# EAGLE schematic DumbCar (EAGLE 7.7.0)

## Sheet 1 of 2
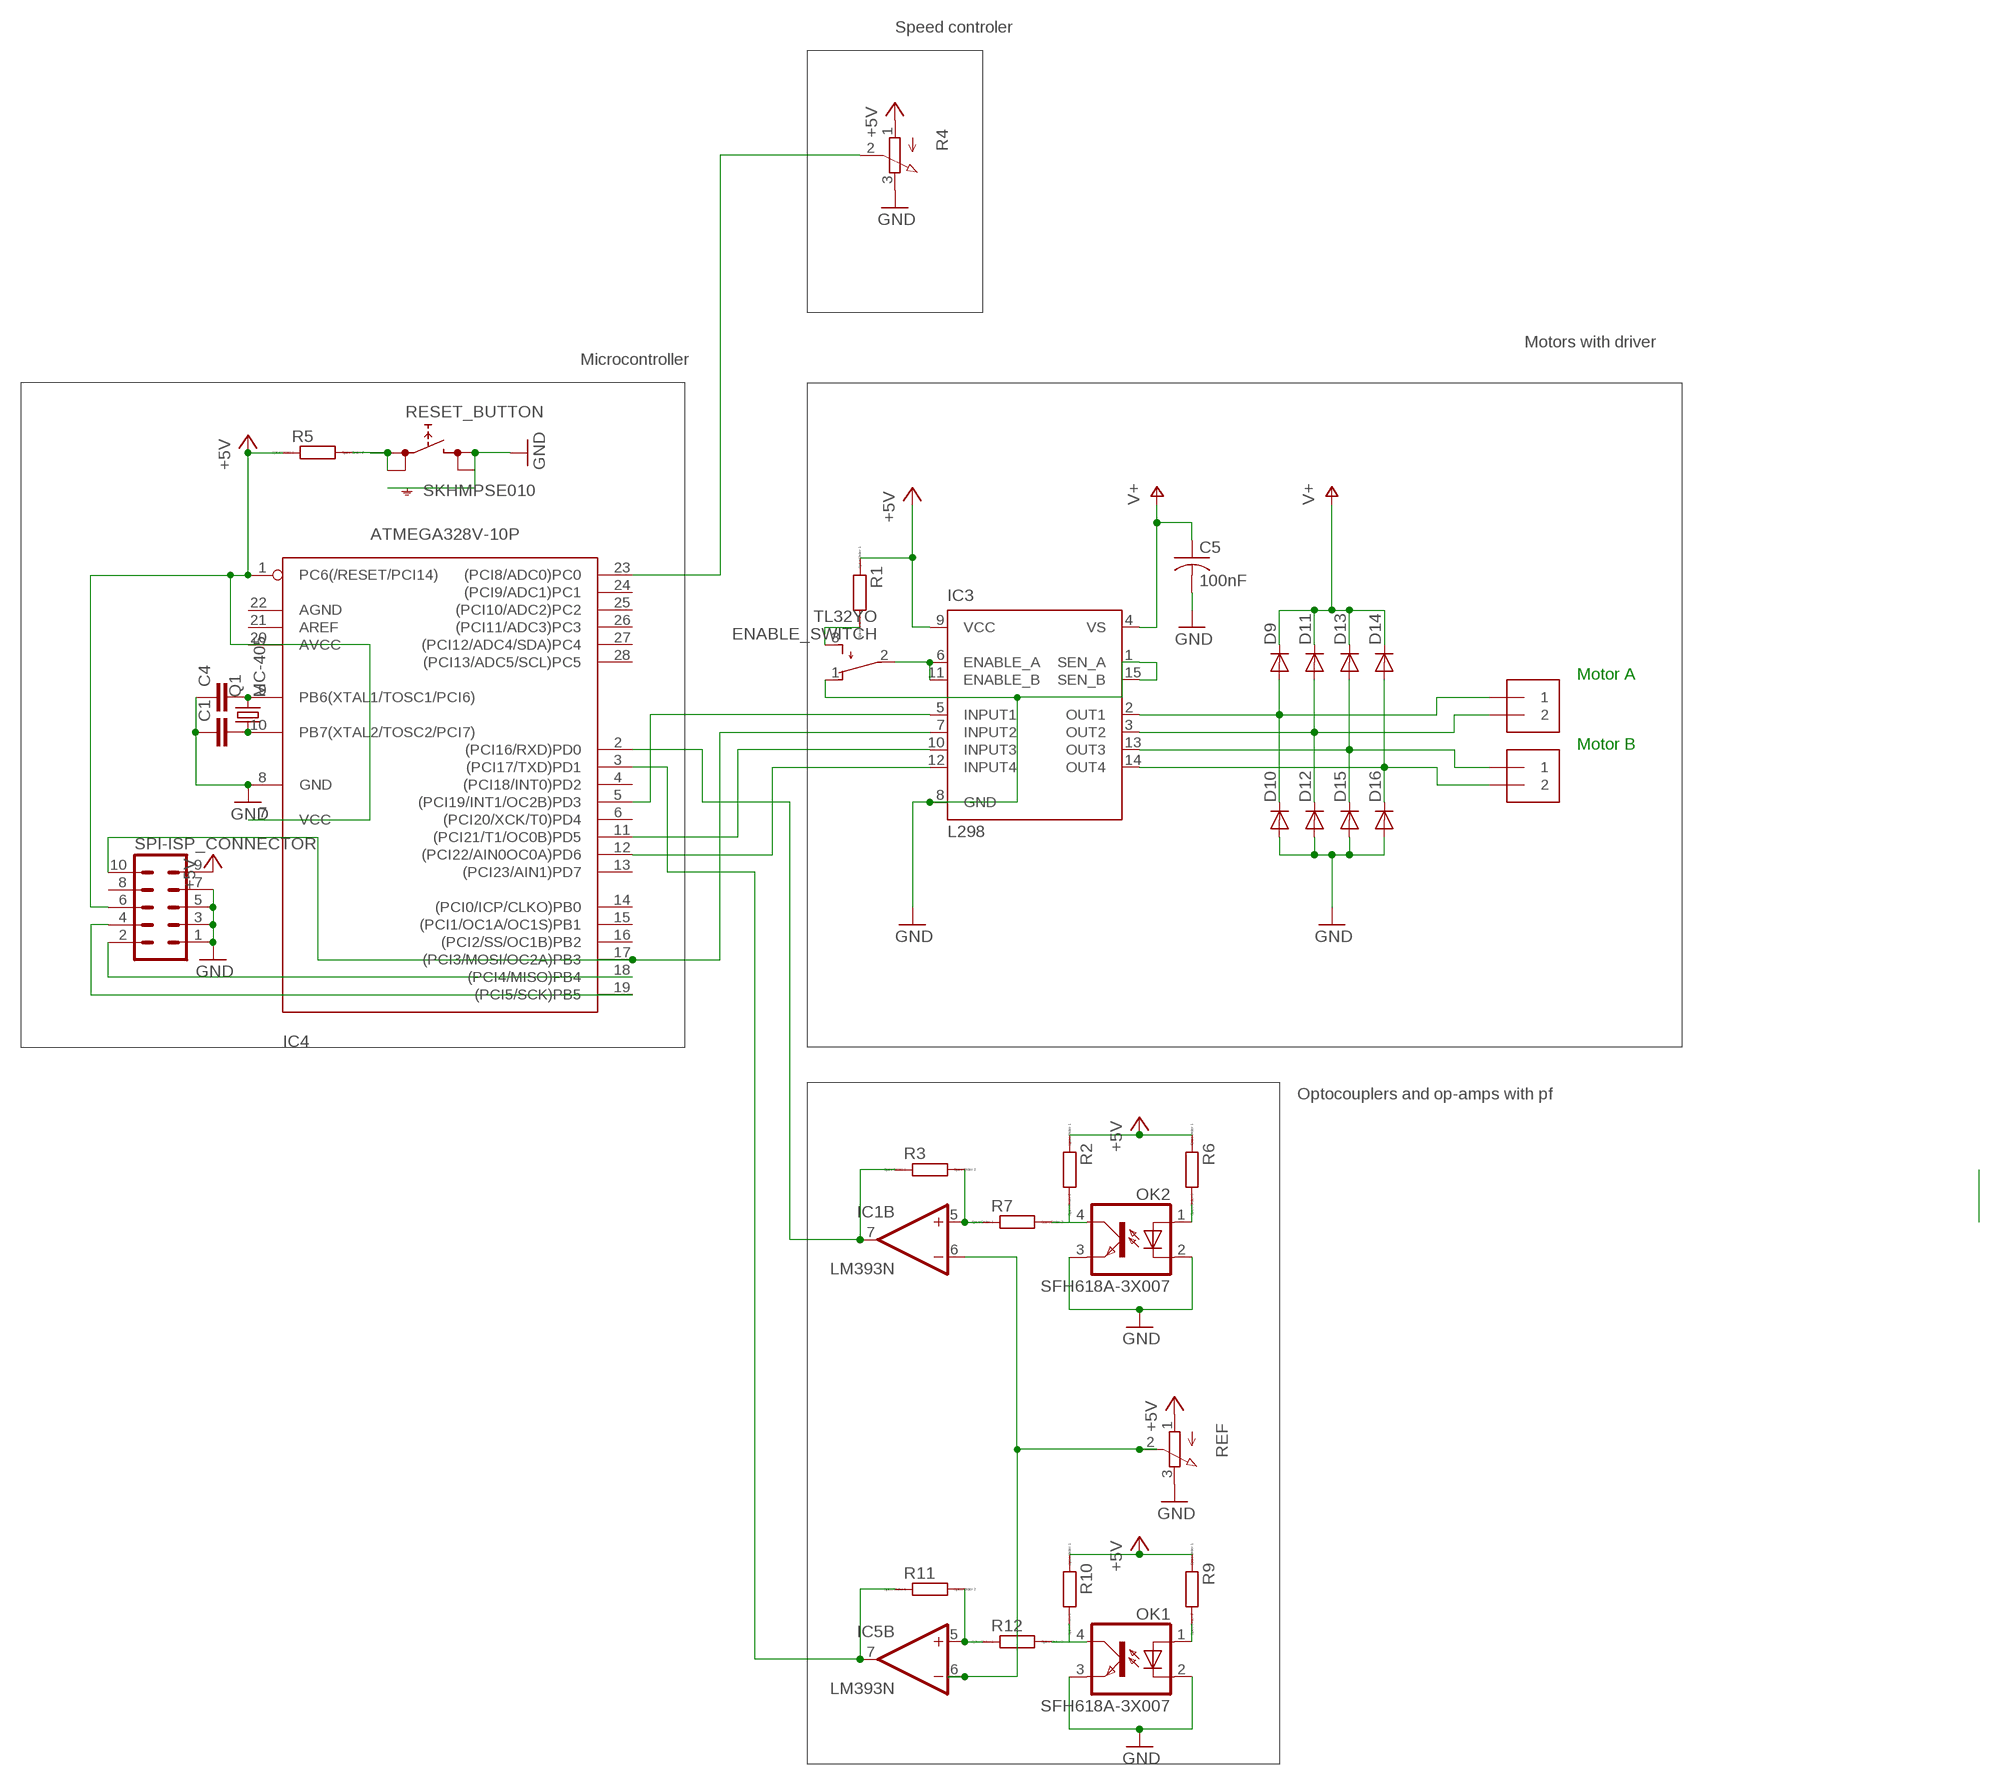
[diagram p0: schematic, sheet 1]

### Parts
C1  C2.5/5  [C2.5-5]
C4  C2.5/5  [C2.5-5]
C5  100nF  C-US050-024X044  [C050-024X044]
D9  DIODE-D-5  [D-5]
D10  DIODE-D-5  [D-5]
D11  DIODE-D-5  [D-5]
D12  DIODE-D-5  [D-5]
D13  DIODE-D-5  [D-5]
D14  DIODE-D-5  [D-5]
D15  DIODE-D-5  [D-5]
D16  DIODE-D-5  [D-5]
ENABLE_SWITCH  TL32YO  [TL3XYO]
IC1  LM393N  [DIL08]
IC3  L298  [MULTIWATT-15]
IC4  ATMEGA328V-10P  [DIL28-3]
IC5  LM393N  [DIL08]
J6  1X2-3.5MM  [1X2-3.5MM]
J7  1X2-3.5MM  [1X2-3.5MM]
OK1  SFH618A-3X007  [SMD4-7]
OK2  SFH618A-3X007  [SMD4-7]
Q1  MC-405  [MC-405]
R1  R0204/7  [0204/7]
R2  R0204/7  [0204/7]
R3  R0204/7  [0204/7]
R4  3RP/1610N  [3RP/1610N]
R5  R0204/7  [0204/7]
R6  R0204/7  [0204/7]
R7  R0204/7  [0204/7]
R9  R0204/7  [0204/7]
R10  R0204/7  [0204/7]
R11  R0204/7  [0204/7]
R12  R0204/7  [0204/7]
REF  3RP/1610N  [3RP/1610N]
RESET_BUTTON  SKHMPSE010  [SKHMPXE010]
SPI-ISP_CONNECTOR  MA05-2  [MA05-2]

### Nets
+5V: IC3.9(VCC) IC4.1(PC6(/RESET/PCI14)) IC4.7(VCC) IC4.20(AVCC) R1.1 R2.1 R4.1(A) R5.1 R6.1 R9.1 R10.1 REF.1(A) SPI-ISP_CONNECTOR.6 SPI-ISP_CONNECTOR.9 ; also sheet 2
GND: C1.1 C4.1 C5.2 D10.A D12.A D15.A D16.A ENABLE_SWITCH.1(O) IC3.1(SEN_A) IC3.8(GND) IC3.15(SEN_B) IC4.8(GND) OK1.2(C) OK1.3(EMIT) OK2.2(C) OK2.3(EMIT) R4.3(E) REF.3(E) RESET_BUTTON.3(2.1) RESET_BUTTON.4(2.2) RESET_BUTTON.5(SH) SPI-ISP_CONNECTOR.1 SPI-ISP_CONNECTOR.3 SPI-ISP_CONNECTOR.5 SPI-ISP_CONNECTOR.7 ; also sheet 2
N$11: D9.A D10.C IC3.2(OUT1) J6.1
N$12: D11.A D12.C IC3.3(OUT2) J6.2
N$13: D14.A D16.C IC3.14(OUT4) J7.2
N$14: D13.A D15.C IC3.13(OUT3) J7.1
N$15: ENABLE_SWITCH.2(P) IC3.6(ENABLE_A) IC3.11(ENABLE_B)
N$16: C4.2 IC4.9(PB6(XTAL1/TOSC1/PCI6)) Q1.2
N$17: ENABLE_SWITCH.3(S) R1.2
N$18: C1.2 IC4.10(PB7(XTAL2/TOSC2/PCI7)) Q1.1
N$19: R5.2 RESET_BUTTON.1(1.1) RESET_BUTTON.2(1.2)
N$20: IC3.7(INPUT2) IC4.17((PCI3/MOSI/OC2A)PB3) SPI-ISP_CONNECTOR.10
N$21: OK2.1(A) R6.2
N$22: IC4.19((PCI5/SCK)PB5) SPI-ISP_CONNECTOR.4
N$23: IC4.18((PCI4/MISO)PB4) SPI-ISP_CONNECTOR.2
N$24: OK2.4(COL) R2.2
N$25: OK1.1(A) R9.2
N$26: OK1.4(COL) R10.2
N$27: IC1.5(B:+IN) R3.2 R7.1
N$28: R7.2
N$29: IC1.7(B:OUT) IC4.2((PCI16/RXD)PD0) R3.1
N$30: IC5.5(B:+IN) R11.2 R12.1
N$31: R12.2
N$32: IC4.3((PCI17/TXD)PD1) IC5.7(B:OUT) R11.1
N$33: IC1.6(B:-IN) IC5.6(B:-IN) REF.2(S)
N$34: IC3.5(INPUT1) IC4.5((PCI19/INT1/OC2B)PD3)
N$35: IC3.10(INPUT3) IC4.11((PCI21/T1/OC0B)PD5)
N$36: IC3.12(INPUT4) IC4.12((PCI22/AIN0OC0A)PD6)
N$37: IC4.23((PCI8/ADC0)PC0) R4.2(S)
V+: C5.1 D9.C D11.C D13.C D14.C IC3.4(VS) ; also sheet 2
Unconnected: IC1.1(A:OUT) IC1.2(A:-IN) IC1.3(A:+IN) IC4.4((PCI18/INT0)PD2) IC4.6((PCI20/XCK/T0)PD4) IC4.13((PCI23/AIN1)PD7) IC4.14((PCI0/ICP/CLKO)PB0) IC4.15((PCI1/OC1A/OC1S)PB1) IC4.16((PCI2/SS/OC1B)PB2) IC4.21(AREF) IC4.22(AGND) IC4.24((PCI9/ADC1)PC1) IC4.25((PCI10/ADC2)PC2) IC4.26((PCI11/ADC3)PC3) IC4.27((PCI12/ADC4/SDA)PC4) IC4.28((PCI13/ADC5/SCL)PC5) IC5.1(A:OUT) IC5.2(A:-IN) IC5.3(A:+IN) SPI-ISP_CONNECTOR.8

### Notes on the sheet
- Speed controler
- Motors with driver
- Microcontroller
- Motor A
- Motor B
- Optocouplers and op-amps with pf

## Sheet 2 of 2
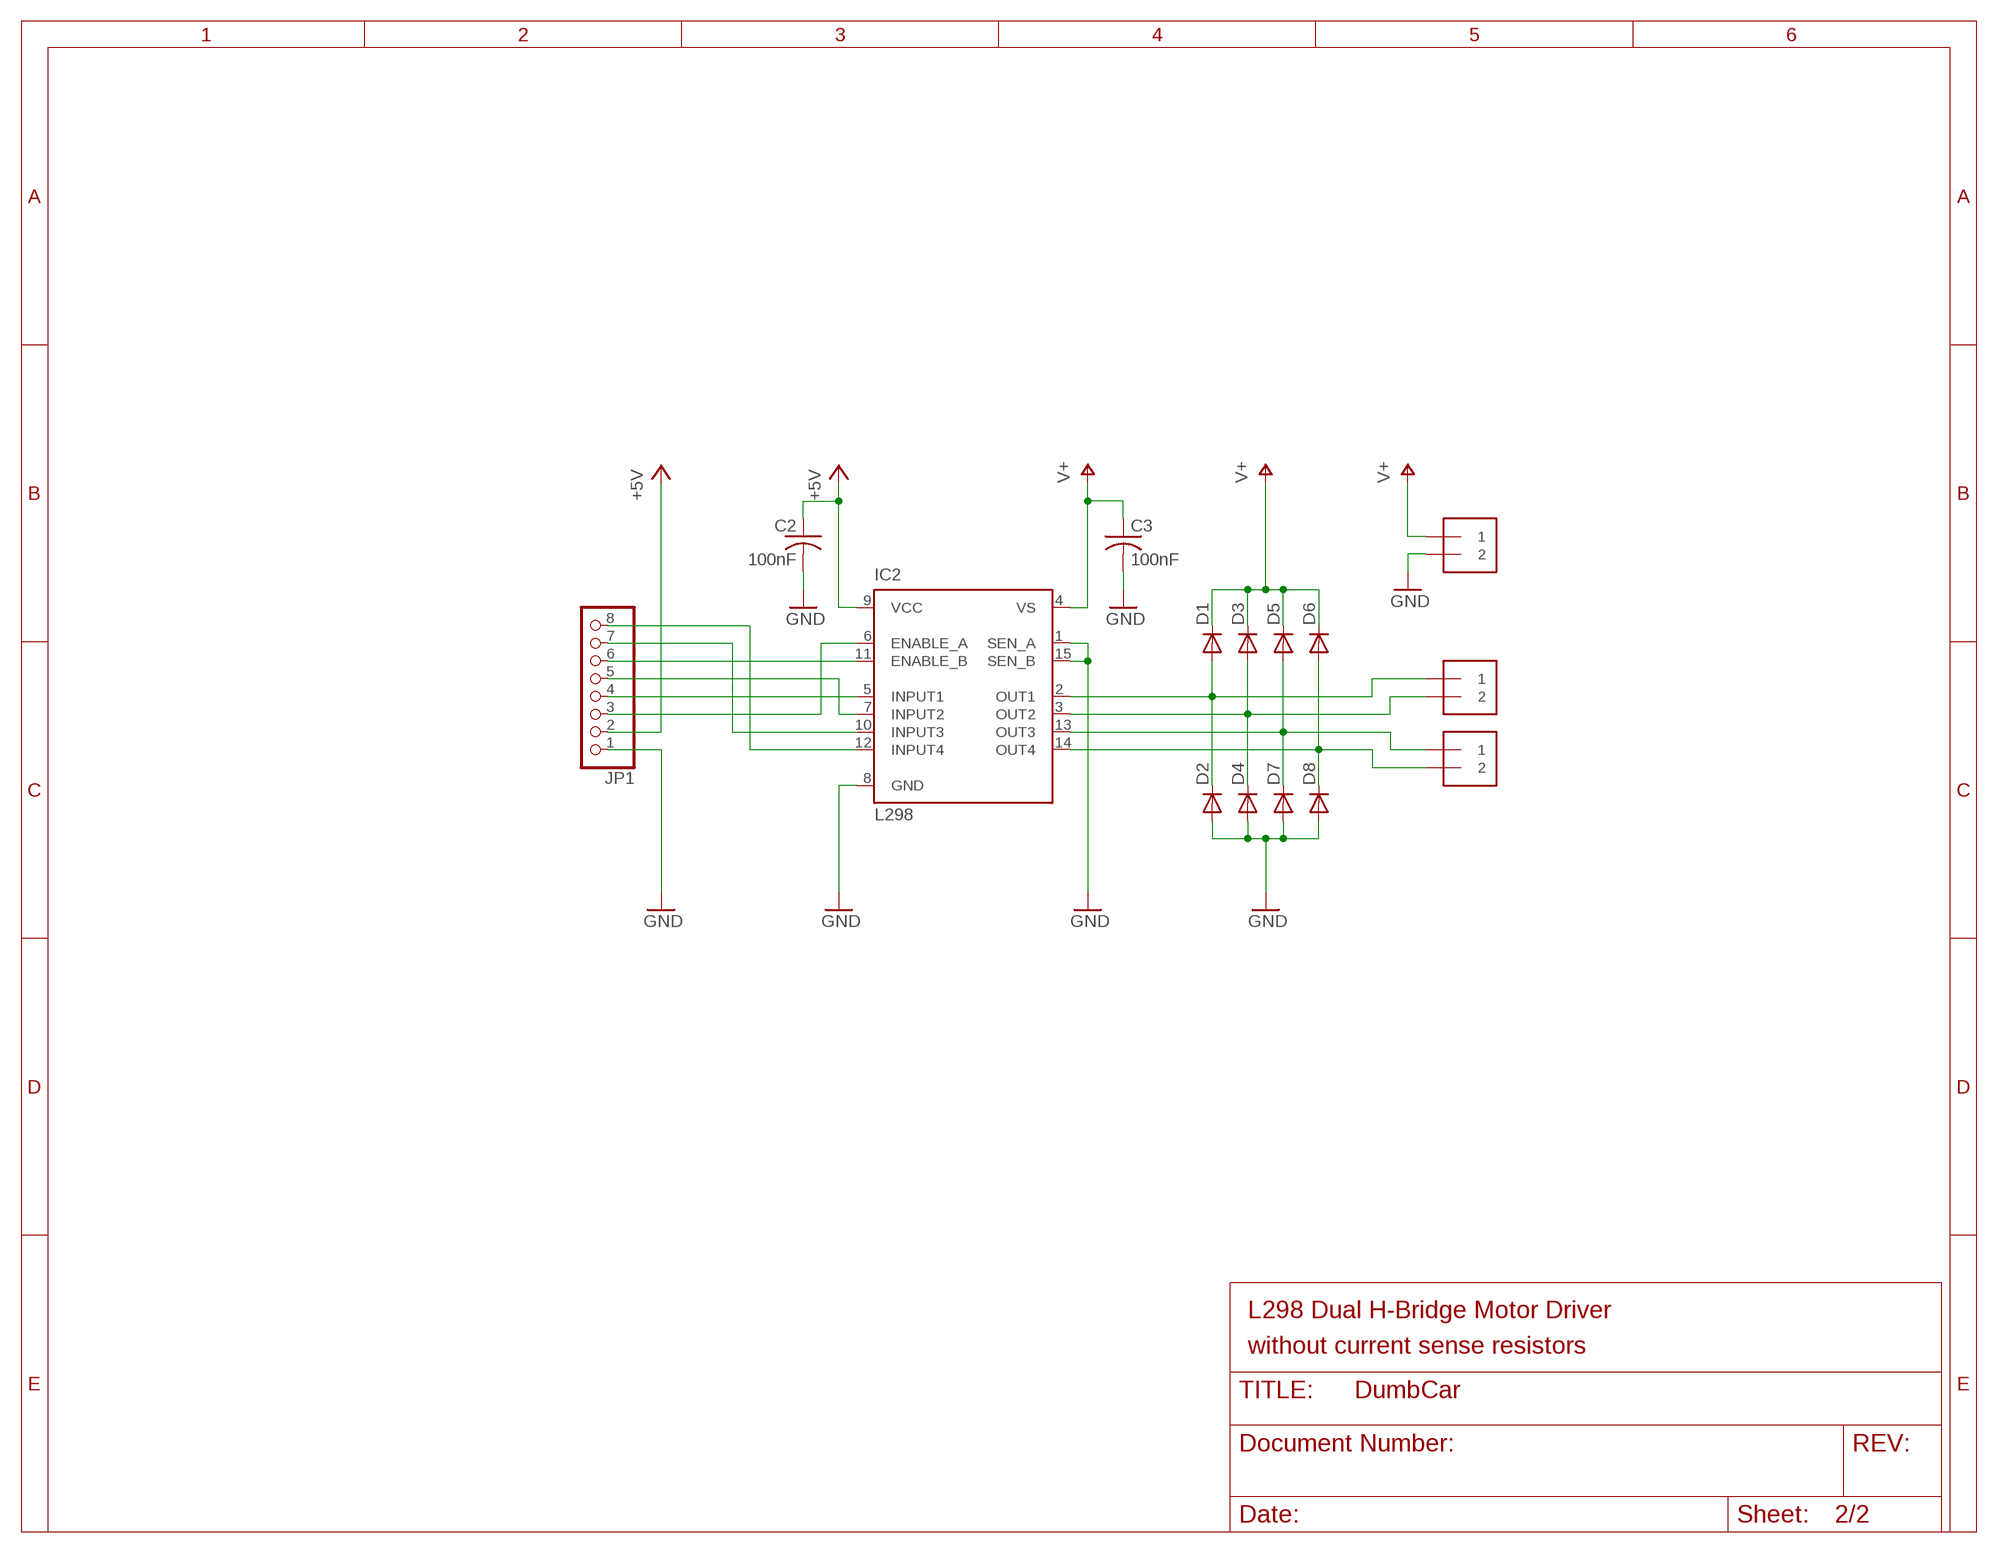
[diagram p1: schematic, sheet 2]

### Parts
C2  100nF  C-US050-024X044  [C050-024X044]
C3  100nF  C-US050-024X044  [C050-024X044]
D1  DIODE-D-5  [D-5]
D2  DIODE-D-5  [D-5]
D3  DIODE-D-5  [D-5]
D4  DIODE-D-5  [D-5]
D5  DIODE-D-5  [D-5]
D6  DIODE-D-5  [D-5]
D7  DIODE-D-5  [D-5]
D8  DIODE-D-5  [D-5]
IC2  L298  [MULTIWATT-15]
J2  1X2-3.5MM  [1X2-3.5MM]
J3  1X2-3.5MM  [1X2-3.5MM]
J4  1X2-3.5MM  [1X2-3.5MM]
JP1  PINHD-1X8  [1X08]

### Nets
+5V: C2.1 IC2.9(VCC) JP1.2 ; also sheet 1
GND: C2.2 C3.2 D2.A D4.A D7.A D8.A IC2.1(SEN_A) IC2.8(GND) IC2.15(SEN_B) J2.2 JP1.1 ; also sheet 1
N$1: D1.A D2.C IC2.2(OUT1) J3.1
N$2: D3.A D4.C IC2.3(OUT2) J3.2
N$3: D6.A D8.C IC2.14(OUT4) J4.2
N$4: D5.A D7.C IC2.13(OUT3) J4.1
N$5: IC2.5(INPUT1) JP1.4
N$6: IC2.7(INPUT2) JP1.5
N$7: IC2.6(ENABLE_A) JP1.3
N$8: IC2.11(ENABLE_B) JP1.6
N$9: IC2.10(INPUT3) JP1.7
N$10: IC2.12(INPUT4) JP1.8
V+: C3.1 D1.C D3.C D5.C D6.C IC2.4(VS) J2.1 ; also sheet 1

### Notes on the sheet
- L298 Dual H-Bridge Motor Driver
- without current sense resistors

## Power pins joined to a net without a drawn wire
V+: IC1.8(P:V+) IC5.8(P:V+)
V-: IC1.4(P:V-) IC5.4(P:V-)

## Library data of the parts
C1 C4 = capacitor-wima:C: CAPACITOR naming: grid - package width
C2 C3 C5 = rcl:C-US: CAPACITOR, American symbol
D1-D16 = diode:DIODE-: DIODE
ENABLE_SWITCH = switch:TL32YO: TINY SWITCH ON - MOM Source: http://www2.produktinfo.conrad.com/datenblaetter/700000-724999/705152-da-01-de-Subminiaturschalter_TL_36YO.pdf
IC1 IC5 = linear:LM393: COMPARATOR
IC2 IC3 = st-microelectronics:L298: DUAL FULL-BRIDGE DRIVER; MPN: L298N; OC_FARNELL: 1589425; OC_NEWARK: 32M1527
IC4 = ATMEGA328:ATMEGA328*P: MICROCONTROLLER 32 kBytes FLASH 2 kBytes SRAM 1 kBytes EEPROM USART 8-channel 10 bit ADC
J2-J4 J6 J7 = adafruit:1X2: 3.5mm Terminal block http://www.ladyada.net/library/pcb/eaglelibrary.html
JP1 = pinhead:PINHD-1X8: PIN HEADER
OK1 OK2 = optocoupler:SFH618?*: Optocoupler, Phototransistor Output, Low Input Current Source: http://www.vishay.com/docs/83673/sfh618.pdf; OC_FARNELL: unknown; OC_NEWARK: unknown
Q1 = crystal:MC-405: kHz RANGE CRYSTAL UNIT SMD Source: MC-306_405_406_E07X.PDF Homepage <www.epsontoyocom.co.jp>; OC_FARNELL: unknown; OC_NEWARK: unknown
R1-R3 R5-R7 R9-R12 = eagle-ltspice:R: RESISTOR, European symbol; SPICEMODEL: NONE; SPICEPREFIX: R
R4 REF = pot:3RP/1610N: 16mm Potentiometer one level Source: http://www.alphapotentiometers.net/html/16mm_pot_2.html
RESET_BUTTON = switch:SKHMP*E010: 6.2 X 6.5mm TACT Switch (SMD) Source: http://www3.alps.co.jp/WebObjects/catalog.woa/PDF/E/Switch/Tact/SKHM/SKHM.PDF
SPI-ISP_CONNECTOR = con-lstb:MA05-2: PIN HEADER; OC_FARNELL: unknown; OC_NEWARK: unknown